# EAGLE design pir-lite (EAGLE 5.06)
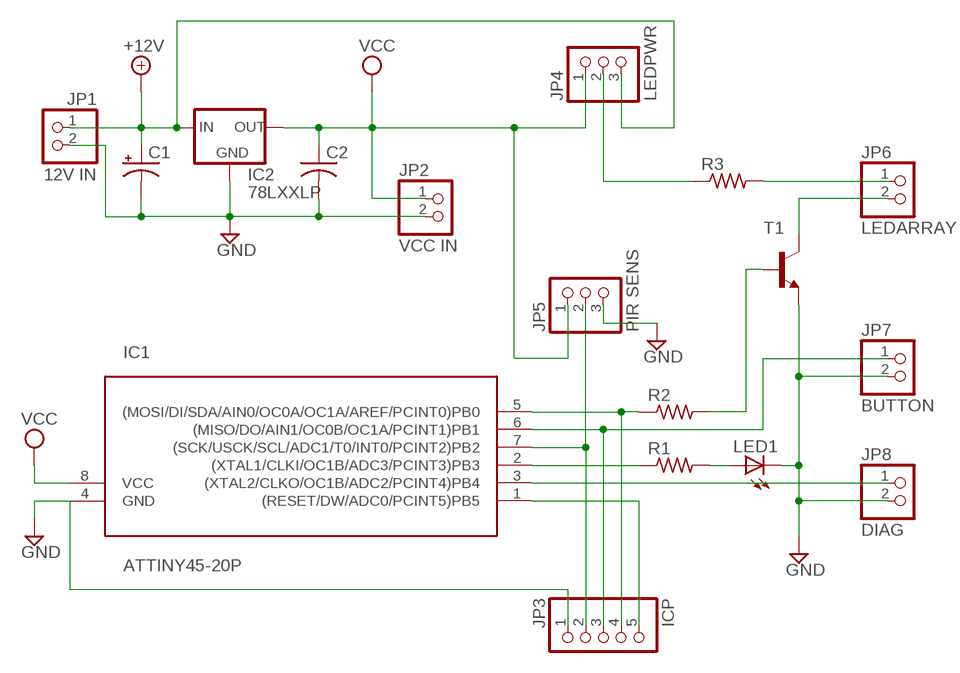
[diagram p0: schematic, sheet 1]

## Parts
C1  CPOL-USE2,5-6E  [E2,5-6E]
C2  C-US025-024X044  [C025-024X044]
IC1  ATTINY45-20P  [DIL08]
IC2  78LXXLP  [TO92D-]
JP1  12V IN  PINHD-1X2  [1X02]
JP2  VCC IN  PINHD-1X2  [1X02]
JP3  ICP  PINHD-1X5  [1X05]
JP4  LEDPWR  PINHD-1X3  [1X03]
JP5  PIR SENS  PINHD-1X3  [1X03]
JP6  LEDARRAY  PINHD-1X2  [1X02]
JP7  BUTTON  PINHD-1X2  [1X02]
JP8  DIAG  PINHD-1X2  [1X02]
LED1  LED3MM  [LED3MM]
R1  R-US_0309/10  [0309/10]
R2  R-US_0309/10  [0309/10]
R3  R-US_0414/15  [0414/15]
T1  -NPN-TO92  [TO92]

## Nets
+12V: C1.+ IC2.3(IN) JP1.1 JP4.3
DIAGLED: LED1.A R1.2
GND: C1.- C2.2 IC1.4(GND) IC2.2(GND) JP1.2 JP2.2 JP3.1 JP5.3 JP7.2 JP8.2 LED1.K(C) T1.1(E)
LEDANODE: JP6.1 R3.2
LEDCATHODE: JP6.2 T1.3(C)
LEDPWR: JP4.2 R3.1
PB0: IC1.5((MOSI/DI/SDA/AIN0/OC0A/OC1A/AREF/PCINT0)PB0) JP3.4 R2.1
PB1: IC1.6((MISO/DO/AIN1/OC0B/OC1A/PCINT1)PB1) JP3.3 JP7.1
PB2: IC1.7((SCK/USCK/SCL/ADC1/T0/INT0/PCINT2)PB2) JP3.2 JP5.2
PB3: IC1.2((XTAL1/CLKI/OC1B/ADC3/PCINT3)PB3) R1.1
PB4: IC1.3((XTAL2/CLKO/OC1B/ADC2/PCINT4)PB4) JP8.1
RST: IC1.1((RESET/DW/ADC0/PCINT5)PB5) JP3.5
T1BASE: R2.2 T1.2(B)
VCC: C2.1 IC1.8(VCC) IC2.1(OUT) JP2.1 JP4.1 JP5.1

## Library data of the parts
C1 = rcl:CPOL-US: POLARIZED CAPACITOR, American symbol
C2 = rcl:C-US: CAPACITOR, American symbol
IC1 = avr:ATTINY45: MICROCONTROLLER 4 Kbytes FLASH 256 bytes EEPROM 256 bytes RAM 4-channel 10 bit ADC USI
IC2 = ads4:78LXX: Linear low-power voltage regulator
JP1 JP2 JP6-JP8 = pinhead:PINHD-1X2: PIN HEADER
JP3 = pinhead:PINHD-1X5: PIN HEADER
JP4 JP5 = pinhead:PINHD-1X3: PIN HEADER
LED1 = led:LED: LED OSRAM: - CHIPLED LG R971, LG N971, LY N971, LG Q971, LY Q971, LO R971, LY R971 LH N974, LH R974 LS Q976, LO Q976, LY Q976 LO Q996 - Hyper CHIPLED LW Q18S LB Q993, LB Q99A, LB R99A - SideLED LS A670, LO A670, LY A670, LG A670, LP A670 LB A673, LV A673, LT A673, LW A673 LH A674 LY A675 LS A676, LA A676, LO A676, LY A676, LW A676 LS A679, LY A679, LG A679 - Hyper Micro SIDELED® LS Y876, LA Y876, LO Y876, LY Y876 LT Y87S - SmartLED LW L88C, LW L88S LB L89C, LB L89S, LG L890 LS L89K, LO L89K, LY L89K LS L896, LA L896, LO L896, LY L896 - TOPLED LS T670, LO T670, LY T670, LG T670, LP T670 LSG T670, LSP T670, LSY T670, LOP T670, LYG T670 LG T671, LOG T671, LSG T671 LB T673, LV T673, LT T673, LW T673 LH T674 LS T676, LA T676, LO T676, LY T676, LB T676, LH T676, LSB T676, LW T676 LB T67C, LV T67C, LT T67C, LS T67K, LO T67K, LY T67K, LW E67C LS E67B, LA E67B, LO E67B, LY E67B, LB E67C, LV E67C, LT E67C LW T67C LS T679, LY T679, LG T679 LS T770, LO T770, LY T770, LG T770, LP T770 LB T773, LV T773, LT T773, LW T773 LH T774 LS E675, LA E675, LY E675, LS T675 LS T776, LA T776, LO T776, LY T776, LB T776 LHGB T686 LT T68C, LB T68C - Hyper Mini TOPLED® LB M676 - Mini TOPLED Santana® LG M470 LS M47K, LO M47K, LY M47K Source: http://www.osram.convergy.de LUXEON: - LUMILED® LXK2-PW12-R00, LXK2-PW12-S00, LXK2-PW14-U00, LXK2-PW14-V00 LXK2-PM12-R00, LXK2-PM12-S00, LXK2-PM14-U00 LXK2-PE12-Q00, LXK2-PE12-R00, LXK2-PE12-S00, LXK2-PE14-T00, LXK2-PE14-U00 LXK2-PB12-K00, LXK2-PB12-L00, LXK2-PB12-M00, LXK2-PB14-N00, LXK2-PB14-P00, LXK2-PB14-Q00 LXK2-PR12-L00, LXK2-PR12-M00, LXK2-PR14-Q00, LXK2-PR14-R00 LXK2-PD12-Q00, LXK2-PD12-R00, LXK2-PD12-S00 LXK2-PH12-R00, LXK2-PH12-S00 LXK2-PL12-P00, LXK2-PL12-Q00, LXK2-PL12-R00 Source: www.luxeon.com KINGBRIGHT: KA-3528ASYC Source: www.kingbright.com
R1-R3 = rcl:R-US_: RESISTOR, American symbol
T1 = transistor:*-NPN-: NPN Transistror BF959 corrected 2008.03.06

## Board
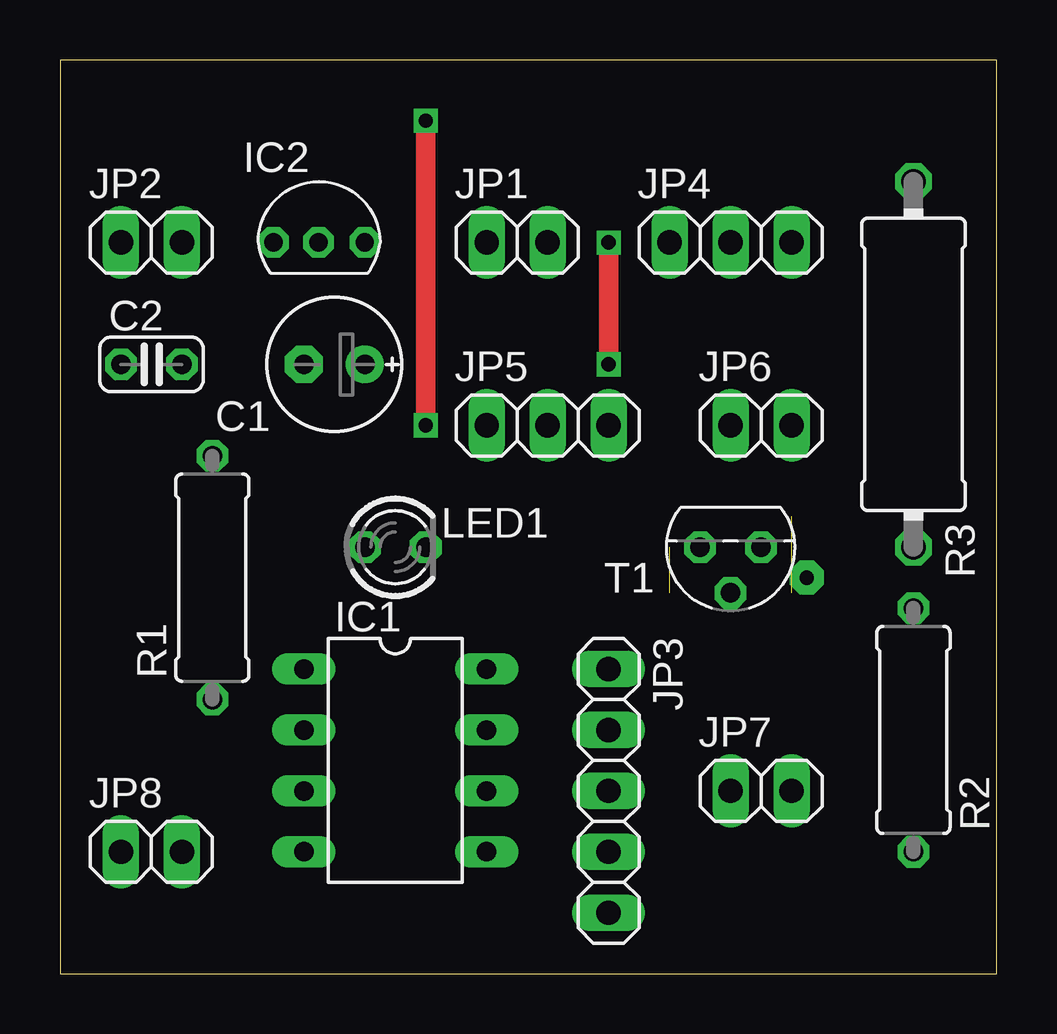
[diagram p1: board, top side]
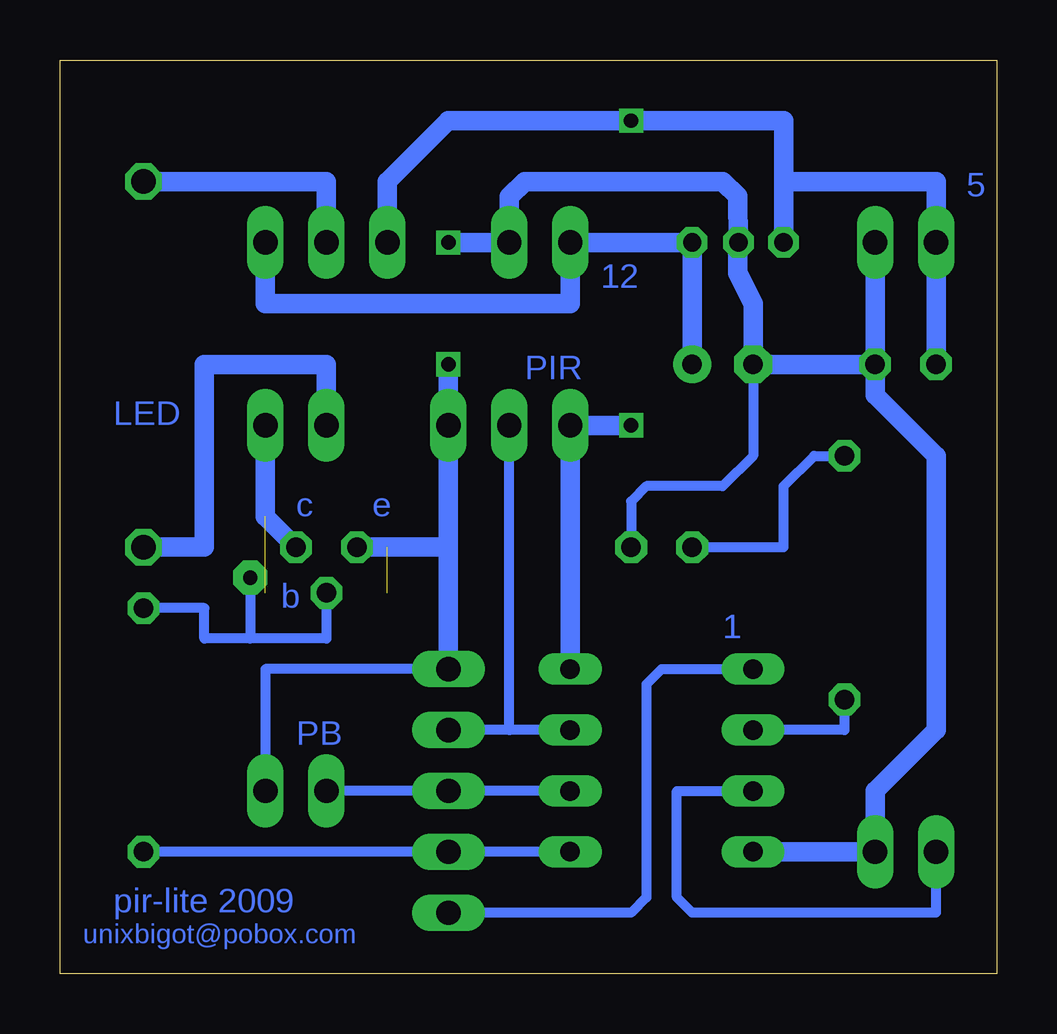
[diagram p2: board, bottom side, seen from below]

Size 39.04 x 38.09 mm. Coordinates in mm from the lower left corner, seen from the top.
Outline: 0,0 39.04,0 39.04,38.09 0,38.09 0,0
Copper layers (1*16): Top 0.035mm / dielectric 1.5mm / Bottom 0.035mm
Design rules "default": minimum track width 10mil, minimum drill 0.6mm, track to track 8mil, track to pad 8mil, pad to pad 8mil, via to via 8mil, smd to smd 8mil, copper to edge 40mil, drill to drill 8mil, minimum pad ring 10mil, minimum via ring 8mil, stop-mask expansion 4mil, vias tented up to drill 0mil, thermal gap 10mil

### Footprints (pad centres in the part's own frame; a part is rotated, then mirrored left to right if it is on the bottom)
E2,5-6E = drill 0.813 pad 1.575 round: + -1.27,0 | drill 0.813 pad 1.575 octagon: - 1.27,0
C025-024X044 = drill 0.813 octagon: 1 -1.27,0; 2 1.27,0
DIL08 = drill 0.813 long: 1 -3.81,-3.81; 2 -1.27,-3.81; 3 1.27,-3.81; 4 3.81,-3.81; 5 3.81,3.81; 6 1.27,3.81; 7 -1.27,3.81; 8 -3.81,3.81
TO92D- = drill 0.762 octagon: 1 -1.905,0; 2 -0.025,0; 3 1.905,0
1X02 = drill 1.016 long: 1 -1.27,0; 2 1.27,0
1X05 = drill 1.016 long: 1 -5.08,0; 2 -2.54,0; 3 0,0; 4 2.54,0; 5 5.08,0
1X03 = drill 1.016 long: 1 -2.54,0; 2 0,0; 3 2.54,0
LED3MM = drill 0.813 octagon: A -1.27,0; K 1.27,0
0309/10 = drill 0.813 octagon: 1 -5.08,0; 2 5.08,0
0414/15 = drill 1.016 octagon: 1 -7.62,0; 2 7.62,0
TO92 = drill 0.813 octagon: 1 1.27,0; 2 0,1.905; 3 -1.27,0

### Placement (x,y rotation side)
C1  11.43,25.4 180 top
C2  3.81,25.4 0 top
IC1  13.97,8.89 270 top
IC2  10.79,30.48 0 top
JP1  19.05,30.48 0 top
JP2  3.81,30.48 0 top
JP3  22.86,7.62 270 top
JP4  27.94,30.48 0 top
JP5  20.32,22.86 0 top
JP6  29.21,22.86 0 top
JP7  29.21,7.62 0 top
JP8  3.81,5.08 0 top
LED1  13.97,17.78 0 top
R1  6.35,16.51 90 top
R2  35.56,10.16 90 top
R3  35.56,25.4 270 top
T1  27.94,17.78 180 top

### Tracks (layer width: path | path; a pad name or v marks a point on that pad's centre or on a via)
+12V
  Bottom 0.813: JP4.3 30.48,27.94 17.78,27.94 JP1.1 IC2.3 C1.+
DIAGLED
  Bottom 0.406: R1.2 7.62,21.59 8.89,20.32 8.89,17.78 LED1.A
GND  (via drill 0.6)  (2 unrouted)
  Top 0.813: v22.86,30.48 v22.86,25.4
  Bottom 0.406: JP3.1 30.48,12.7 JP7.2 | LED1.K 15.24,19.68 14.61,20.32 11.43,20.32 10.16,21.59 C1.-
  Bottom 0.813: C2.2 JP2.2 | C2.2 5.08,24.13 2.54,21.59 2.54,10.16 5.08,7.62 JP8.2 IC1.4 | C2.2 C1.- 10.16,27.94 10.79,29.21 10.79,30.45 IC2.2 10.79,32.41 11.43,33.02 19.68,33.02 20.32,32.38 JP1.2 v22.86,30.48 | v22.86,25.4 JP5.3 22.86,17.78 | 22.86,17.78 JP3.1 | 22.86,17.78 25.4,17.78 T1.1
LEDANODE
  Bottom 0.813: R3.2 33.02,17.78 33.02,25.4 27.94,25.4 JP6.1
LEDCATHODE  (2 unrouted)
  Bottom 0.813: JP6.2 30.48,19.05 T1.3
LEDPWR
  Bottom 0.813: JP4.2 27.94,33.02 R3.1
PB0
  Bottom 0.406: IC1.5 JP3.4 R2.1
PB1
  Bottom 0.406: IC1.6 JP3.3 JP7.1
PB2
  Bottom 0.406: IC1.7 20.32,10.16 | 20.32,10.16 JP3.2 | 20.32,10.16 JP5.2
PB3
  Bottom 0.406: IC1.2 6.35,10.16 R1.1
PB4
  Bottom 0.406: IC1.3 13.34,7.62 13.34,3.17 12.7,2.54 2.54,2.54 JP8.1
RST
  Bottom 0.406: IC1.1 13.97,12.7 14.61,12.06 14.61,3.17 15.24,2.54 JP3.5
T1BASE  (via drill 0.6 pad 1.42)
  Bottom 0.406: T1.2 27.94,13.97 31.11,13.97 | 31.11,13.97 33.02,13.97 33.02,15.24 R2.2 | v31.11,16.51 31.11,13.97
VCC  (via drill 0.6)
  Top 0.813: v15.24,35.56 v15.24,22.86
  Bottom 0.813: C2.1 JP2.1 2.54,33.02 8.89,33.02 | 8.89,33.02 IC2.1 | 8.89,33.02 8.89,35.56 v15.24,35.56 22.86,35.56 25.4,33.02 JP4.1 | JP5.1 IC1.8 JP5.1 | v15.24,22.86 JP5.1

### Text on the board
Bottom: 5 | 12 | PIR | LED | e | c | b | 1 | PB | pir-lite 2009 | unixbigot@pobox.com